# EAGLE design Type4me (EAGLE 6.3)
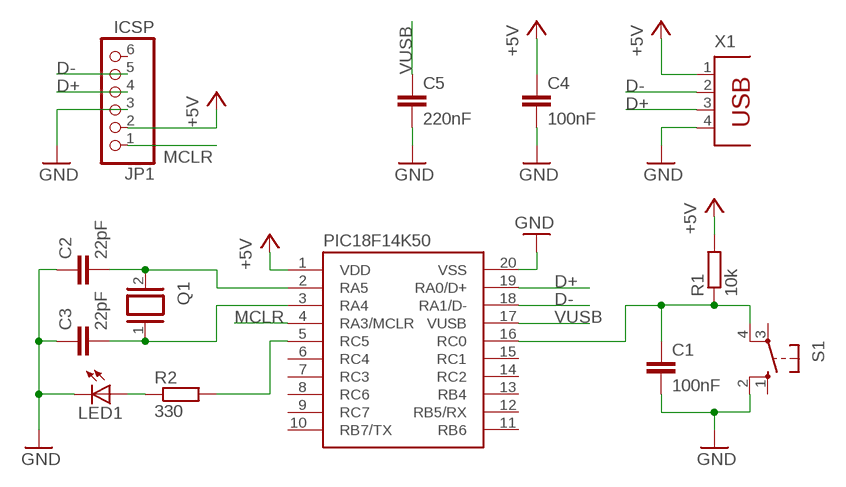
[diagram p0: schematic, sheet 1]

## Parts
C1  100nF  C-EU050-030X075  [C050-030X075]
C2  22pF  C-EU025-030X050  [C025-030X050]
C3  22pF  C-EU025-030X050  [C025-030X050]
C4  100nF  C-EU050-030X075  [C050-030X075]
C5  220nF  C-EU050-030X075  [C050-030X075]
JP1  ICSP  PINHD-1X6  [1X06]
LED1  LED5MM  [LED5MM]
Q1  XTAL/S  [QS]
R1  10k  R-EU_0207/12  [0207/12]
R2  330  R-EU_0207/12  [0207/12]
S1  10-XX  [B3F-10XX]
U$1  PIC18F14K50  [DIP-20]
X1  PN61729  [PN61729]

## Nets
+5V: C4.1 JP1.2 R1.2 U$1.1(VDD) X1.1
D+: JP1.4 U$1.19(RA0/D+) X1.3
D-: JP1.5 U$1.18(RA1/D-) X1.2
GND: C1.2 C2.1 C3.1 C4.2 C5.2 JP1.3 LED1.K(C) S1.2(S1) U$1.20(VSS) X1.4
MCLR: JP1.1 U$1.4(RA3/MCLR)
N$1: C2.2 Q1.2 U$1.2(RA5)
N$2: C3.2 Q1.1 U$1.3(RA4)
N$3: C1.1 R1.1 S1.4(P1) U$1.16(RC0)
N$7: R2.2 U$1.5(RC5)
N$8: LED1.A R2.1
VUSB: C5.1 U$1.17(VUSB)
Unconnected: JP1.6 S1.1(S) S1.3(P) U$1.6(RC4) U$1.7(RC3) U$1.8(RC6) U$1.9(RC7) U$1.10(RB7/TX) U$1.11(RB6) U$1.12(RB5/RX) U$1.13(RB4) U$1.14(RC2) U$1.15(RC1)

## Library data of the parts
C1-C5 = rcl:C-EU: CAPACITOR, European symbol
JP1 = adafruit:PINHD-1X6: PIN HEADER
LED1 = adafruit:LED: LED OSRAM: - CHIPLED LG R971, LG N971, LY N971, LG Q971, LY Q971, LO R971, LY R971 LH N974, LH R974 LS Q976, LO Q976, LY Q976 LO Q996 - Hyper CHIPLED LW Q18S LB Q993, LB Q99A, LB R99A - SideLED LS A670, LO A670, LY A670, LG A670, LP A670 LB A673, LV A673, LT A673, LW A673 LH A674 LY A675 LS A676, LA A676, LO A676, LY A676, LW A676 LS A679, LY A679, LG A679 - Hyper Micro SIDELED® LS Y876, LA Y876, LO Y876, LY Y876 LT Y87S - SmartLED LW L88C, LW L88S LB L89C, LB L89S, LG L890 LS L89K, LO L89K, LY L89K LS L896, LA L896, LO L896, LY L896 - TOPLED LS T670, LO T670, LY T670, LG T670, LP T670 LSG T670, LSP T670, LSY T670, LOP T670, LYG T670 LG T671, LOG T671, LSG T671 LB T673, LV T673, LT T673, LW T673 LH T674 LS T676, LA T676, LO T676, LY T676, LB T676, LH T676, LSB T676, LW T676 LB T67C, LV T67C, LT T67C, LS T67K, LO T67K, LY T67K, LW E67C LS E67B, LA E67B, LO E67B, LY E67B, LB E67C, LV E67C, LT E67C LW T67C LS T679, LY T679, LG T679 LS T770, LO T770, LY T770, LG T770, LP T770 LB T773, LV T773, LT T773, LW T773 LH T774 LS E675, LA E675, LY E675, LS T675 LS T776, LA T776, LO T776, LY T776, LB T776 LHGB T686 LT T68C, LB T68C - Hyper Mini TOPLED® LB M676 - Mini TOPLED Santana® LG M470 LS M47K, LO M47K, LY M47K Source: http://www.osram.convergy.de/
Q1 = special:XTAL/S: CRYSTAL
R1 R2 = rcl:R-EU_: RESISTOR, European symbol
S1 = switch-omron:10-XX: OMRON SWITCH; MPN: B3F-1000; OC_FARNELL: 176432; OC_NEWARK: 36M3542
U$1 = ChromSys_eagleparts_v2:PIC18F14K50
X1 = con-berg:PN61729: BERG USB connector; OC_FARNELL: unknown; OC_NEWARK: unknown

## Board
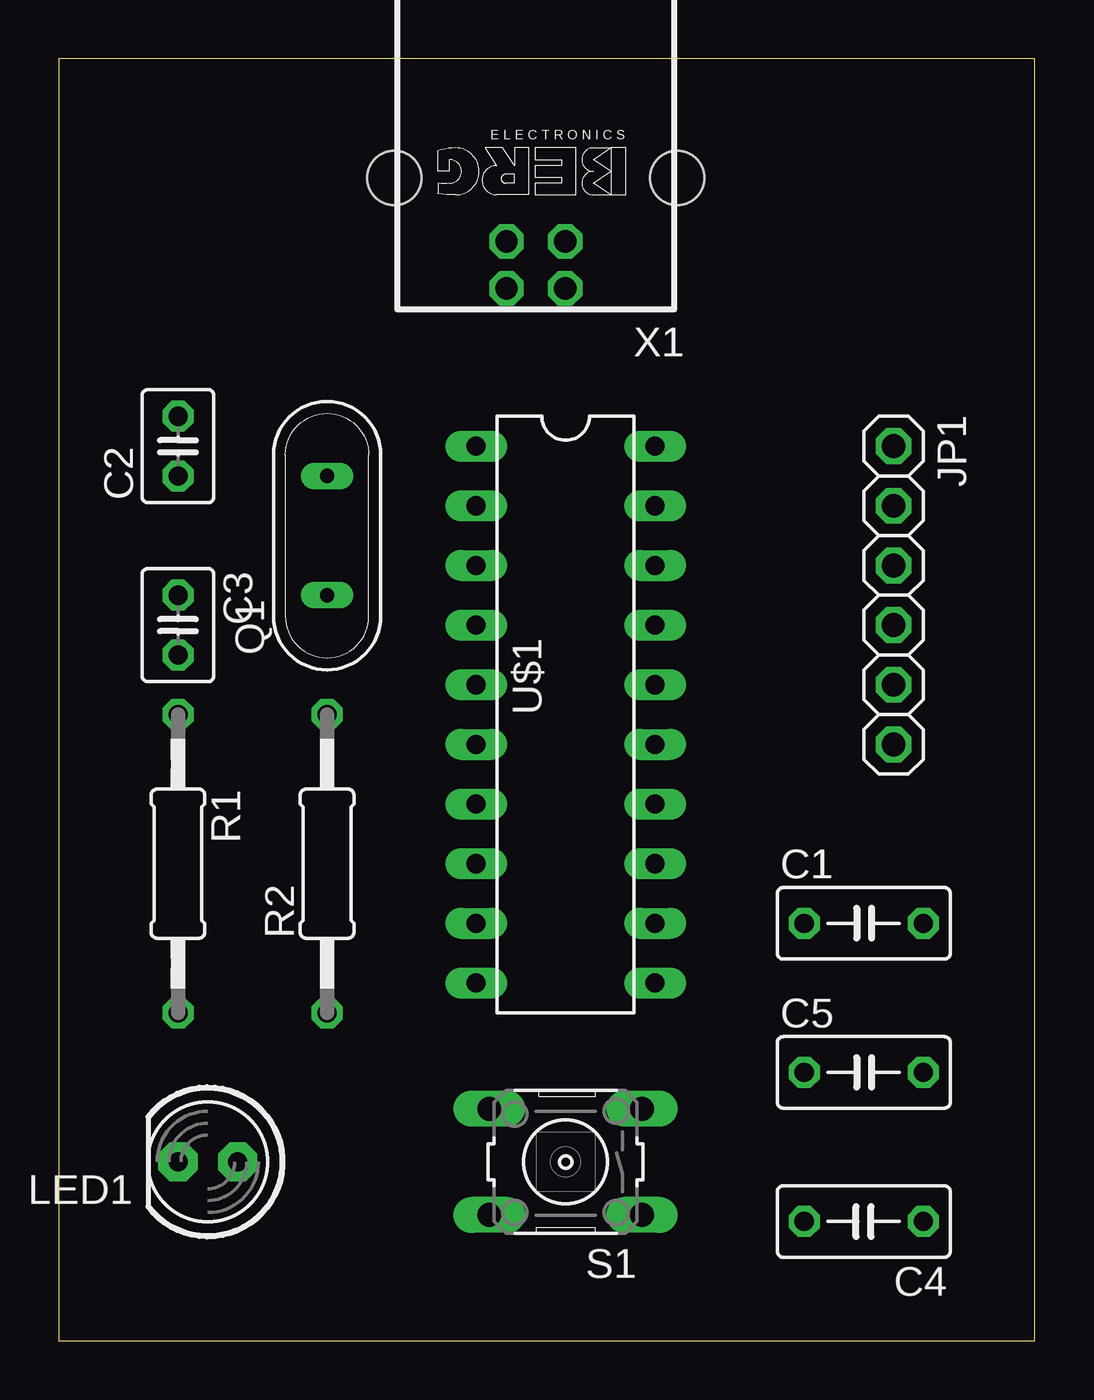
[diagram p1: board, top side]
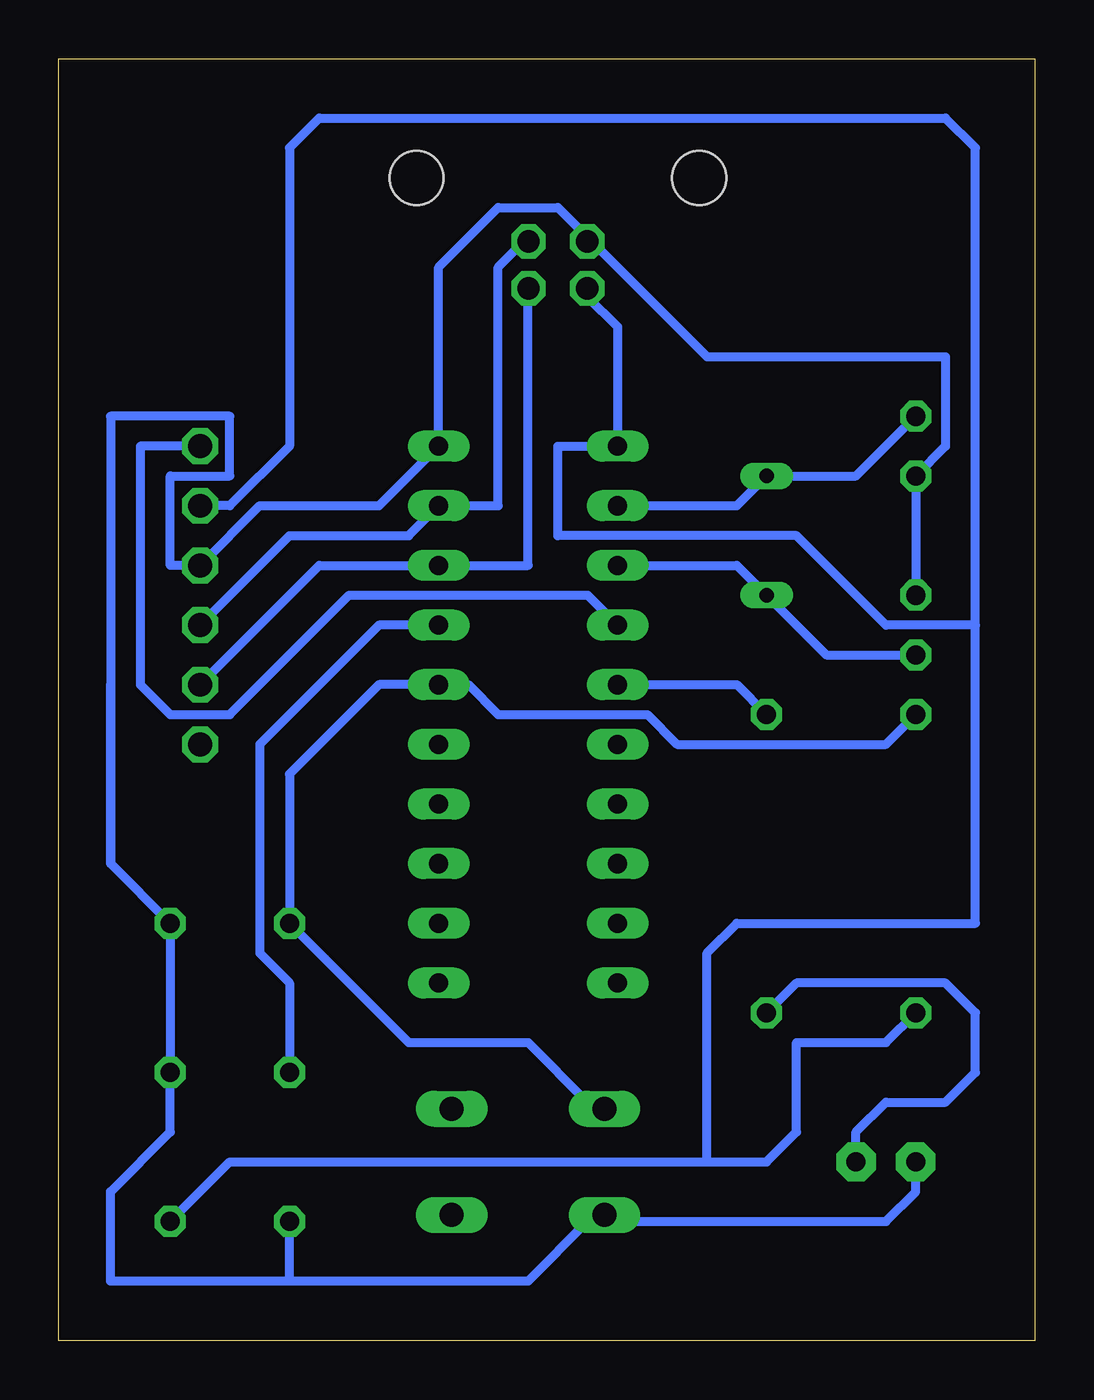
[diagram p2: board, bottom side, seen from below]

Size 41.58 x 54.6 mm. Coordinates in mm from the lower left corner, seen from the top.
Outline: 0,0 41.58,0 41.58,54.6 0,54.6 0,0
Copper layers (1*16): Top 0.035mm / dielectric 1.5mm / Bottom 0.035mm
Design rules "default *": minimum track width 15mil, minimum drill 24mil, track to track 8mil, track to pad 8mil, pad to pad 8mil, via to via 8mil, smd to smd 8mil, copper to edge 40mil, drill to drill 8mil, minimum pad ring 10mil, minimum via ring 8mil, stop-mask expansion 4mil, vias tented up to drill 0mil, thermal gap 10mil

### Footprints (pad centres in the part's own frame; a part is rotated, then mirrored left to right if it is on the bottom)
C050-030X075 = drill 0.813 octagon: 1 -2.54,0; 2 2.54,0
C025-030X050 = drill 0.813 octagon: 1 -1.27,0; 2 1.27,0
1X06 = drill 1.016 octagon: 1 -6.35,0; 2 -3.81,0; 3 -1.27,0; 4 1.27,0; 5 3.81,0; 6 6.35,0
LED5MM = drill 0.813 pad 1.676 octagon: A -1.27,0; K 1.27,0
QS = drill 0.61 long: 1 -2.54,0; 2 2.54,0
0207/12 = drill 0.813 octagon: 1 -6.35,0; 2 6.35,0
B3F-10XX = drill 1.016 long: 1 -3.251,2.261; 2 3.251,2.261; 3 -3.251,-2.261; 4 3.251,-2.261
DIP-20 = drill 0.813 long: 1 -11.43,-3.81; 2 -8.89,-3.81; 3 -6.35,-3.81; 4 -3.81,-3.81; 5 -1.27,-3.81; 6 1.27,-3.81; 7 3.81,-3.81; 8 6.35,-3.81; 9 8.89,-3.81; 10 11.43,-3.81; 11 11.43,3.81; 12 8.89,3.81; 13 6.35,3.81; 14 3.81,3.81; 15 1.27,3.81; 16 -1.27,3.81; 17 -3.81,3.81; 18 -6.35,3.81; 19 -8.89,3.81; 20 -11.43,3.81
PN61729 = drill 0.95 octagon: 1 1.25,4.71; 2 -1.25,4.71; 3 -1.25,2.71; 4 1.25,2.71 | hole 2.3: -6.02,0; 6.02,0

### Placement (x,y rotation side)
C1  34.29,17.78 0 top
C2  5.08,38.1 90 top
C3  5.08,30.48 270 top
C4  34.29,5.08 180 top
C5  34.29,11.43 0 top
JP1  35.56,31.75 270 top
LED1  6.35,7.62 180 top
Q1  11.43,34.29 90 top
R1  5.08,20.32 270 top
R2  11.43,20.32 90 top
S1  21.59,7.62 180 top
U$1  21.59,26.67 270 top
X1  20.32,49.53 180 top

### Tracks (layer width: path | path; a pad name or v marks a point on that pad's centre or on a via)
+5V
  Bottom 0.381: X1.1 19.05,44.45 17.78,43.18 U$1.1 20.32,38.1 20.32,34.29 10.16,34.29 6.35,30.48 2.54,30.48 | R1.2 6.35,12.7 10.16,12.7 10.16,8.89 11.43,7.62 13.97,7.62 | 13.97,7.62 34.29,7.62 C4.1 | JP1.2 34.29,35.56 31.75,38.1 31.75,50.8 30.48,52.07 3.81,52.07 2.54,50.8 2.54,30.48 | 2.54,30.48 2.54,17.78 12.7,17.78 13.97,16.51 13.97,7.62
D+
  Bottom 0.381: JP1.4 31.75,34.29 26.67,34.29 U$1.19 22.86,35.56 22.86,45.72 21.59,46.99 X1.3
D-
  Bottom 0.381: JP1.5 30.48,33.02 U$1.18 21.59,33.02 21.59,44.45 X1.2
GND
  Bottom 0.381: C1.2 C5.2 36.83,8.89 39.37,6.35 39.37,2.54 31.75,2.54 | 31.75,2.54 C4.2 | 31.75,2.54 21.59,2.54 19.05,5.08 S1.2 17.78,5.08 6.35,5.08 5.08,6.35 LED1.K | C3.1 C2.1 3.81,38.1 3.81,41.91 13.97,41.91 19.05,46.99 | 19.05,46.99 20.32,48.26 22.86,48.26 25.4,45.72 U$1.20 27.94,35.56 33.02,35.56 JP1.3 36.83,33.02 36.83,36.83 34.29,36.83 34.29,39.37 39.37,39.37 39.37,27.94 | 19.05,46.99 X1.4
  Bottom 0.406: 39.37,27.94 39.37,20.32 C1.2
MCLR
  Bottom 0.381: U$1.4 19.05,31.75 29.21,31.75 34.29,26.67 36.83,26.67 38.1,27.94 38.1,38.1 JP1.1
N$1
  Bottom 0.381: U$1.2 12.7,35.56 Q1.2 7.62,36.83 C2.2
N$2
  Bottom 0.381: U$1.3 12.7,33.02 Q1.1 8.89,29.21 C3.2
N$3
  Bottom 0.381: R1.1 6.35,25.4 15.24,25.4 16.51,26.67 22.86,26.67 24.13,27.94 U$1.16 27.94,27.94 31.75,24.13 C1.1 26.67,12.7 21.59,12.7 19.05,10.16 S1.4
N$7
  Bottom 0.381: R2.2 12.7,27.94 U$1.5
N$8
  Bottom 0.381: R2.1 10.16,15.24 3.81,15.24 2.54,13.97 2.54,11.43 3.81,10.16 6.35,10.16 7.62,8.89 LED1.A
VUSB
  Bottom 0.381: C5.1 31.75,15.24 33.02,16.51 33.02,25.4 27.94,30.48 U$1.17